# Altium schematic sheet TIVA_1.SchDoc
size A4
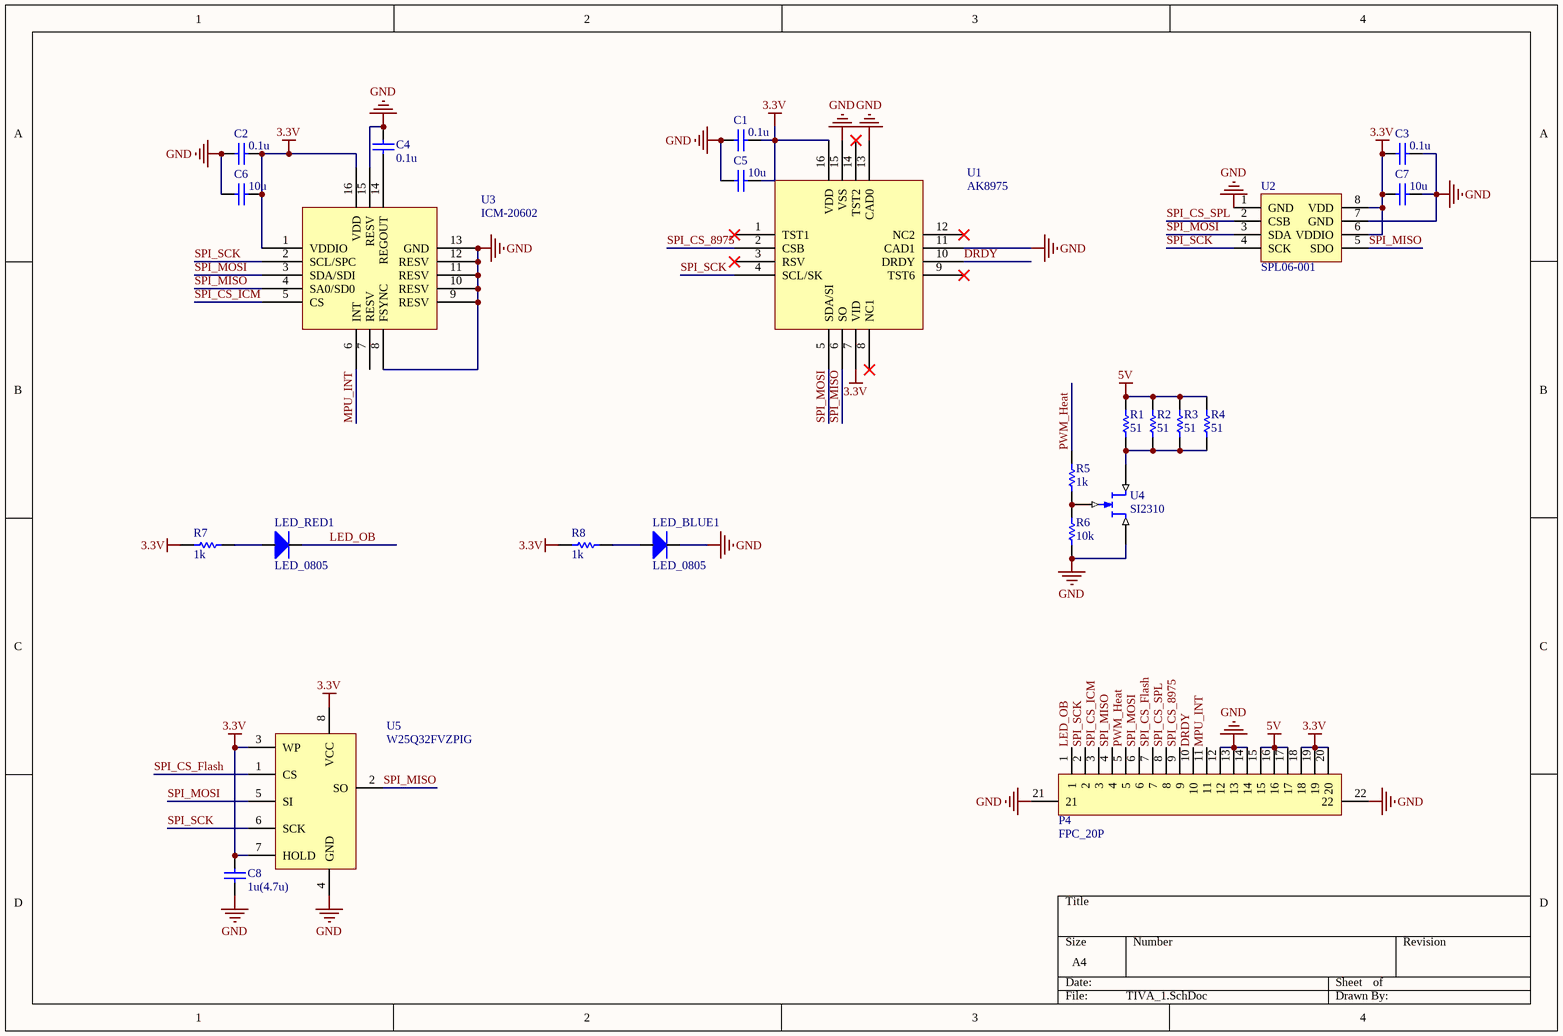
[diagram p0: TIVA_1.SchDoc]

## Parts
C1  0.1u  [C_0805]
C2  0.1u  [C_0805]
C3  0.1u  [C_0805]
C4  0.1u  [C_0805]
C5  10u  [C_0805]
C6  10u  [C_0805]
C7  10u  [C_0805]
C8  1u(4.7u)  [C_0805]
LED_BLUE1  LED_0805  [LED0805]
LED_RED1  LED_0805  [LED0805]
P4  FPC_20P  [FPC1.0_20P]
R1  51  [R_0805]
R2  51  [R_0805]
R3  51  [R_0805]
R4  51  [R_0805]
R5  1k  [R_0805]
R6  10k  [R_0805]
R7  1k  [R_0805]
R8  1k  [R_0805]
U1  AK8975  [QFN16(4*4)]
U2  SPL06-001  [QFN8(2*4F)]
U3  ICM-20602  [QFN16(3+5)]
U4  SI2310  [SOT_23]
U5  W25Q32FVZPIG  [WSON(6*5mm)]

## Nets
3.3V: C1.1 C2.1 C3.2 C5.1 C6.1 C7.2 C8.1 P4.18 P4.19 P4.20 R7.1 R8.1 U1.7(VID) U1.16(VDD) U2.6(VDDIO) U2.8(VDD) U3.1(VDDIO) U3.16(VDD) U5.3(WP) U5.7(HOLD) U5.8(VCC)
5V: P4.15 P4.16 P4.17 R1.2 R2.2 R3.2 R4.2
GND: C1.2 C2.2 C3.1 C4.2 C5.2 C6.2 C7.1 C8.2 LED_BLUE1.2 P4.12 P4.13 P4.14 P4.21 P4.22 R6.1 U1.11(CAD1) U1.13(CAD0) U1.15(VSS) U2.1(GND) U2.7(GND) U3.8(FSYNC) U3.9(RESV) U3.10(RESV) U3.11(RESV) U3.12(RESV) U3.13(GND) U3.15(RESV) U4.2(S) U5.4(GND)
DRDY: P4.10 U1.10(DRDY)
LED_OB: LED_RED1.2 P4.1
MPU_INT: P4.11 U3.6(INT)
PWM_Heat: P4.5 R5.2
SPI_CS_8975: P4.9 U1.2(CSB)
SPI_CS_Flash: P4.7 U5.1(CS)
SPI_CS_ICM: P4.3 U3.5(CS)
SPI_CS_SPL: P4.8 U2.2(CSB)
SPI_MISO: P4.4 U1.6(SO) U2.5(SDO) U3.4(SA0/SD0) U5.2(SO)
SPI_MOSI: P4.6 U1.5(SDA/SI) U2.3(SDA) U3.3(SDA/SDI) U5.5(SI)
SPI_SCK: P4.2 U1.4(SCL/SK) U2.4(SCK) U3.2(SCL/SPC) U5.6(SCK)
NetC4_1: C4.1 U3.14(REGOUT)
NetLED_BLUE1_1: LED_BLUE1.1 R8.2
NetLED_RED1_1: LED_RED1.1 R7.2
NetR1_1: R1.1 R2.1 R3.1 R4.1 U4.3(D)
NetR5_1: R5.1 R6.2 U4.1(G)

Not connected (* = marked no-connect by the designer): U1 1(TST1)* 3(RSV)* 8(NC1)* 9(TST6)* 12(NC2)* 14(TST2)*; U3 7(RESV)

## Library data of the parts
C1-C8 = C_0805
R1-R8 = R_0805
U4 = SI2310_2